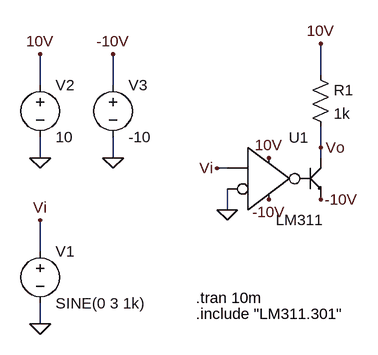
[diagram p0: schematic transferFunction.asc]
transferFunction.asc, the LTspice schematic file:
Version 4
SHEET 1 1300 680
WIRE 960 0 960 -48
WIRE 528 16 528 -32
WIRE 640 16 640 -32
WIRE 960 112 960 80
WIRE 528 128 528 96
WIRE 640 128 640 96
WIRE 960 128 960 112
WIRE 816 144 800 144
WIRE 816 208 816 176
WIRE 528 272 528 224
WIRE 528 384 528 352
FLAG 528 128 0
FLAG 528 384 0
FLAG 528 -32 10V
FLAG 640 128 0
FLAG 640 -32 -10V
FLAG 528 224 Vi
FLAG 880 128 10V
FLAG 880 192 -10V
FLAG 960 -48 10V
FLAG 816 208 0
FLAG 960 192 -10V
FLAG 960 112 Vo
FLAG 800 144 Vi
SYMBOL voltage 528 256 R0
WINDOW 123 0 0 Left 0
WINDOW 39 0 0 Left 0
SYMATTR InstName V1
SYMATTR Value SINE(0 3 1k)
SYMBOL voltage 528 0 R0
WINDOW 123 0 0 Left 0
WINDOW 39 0 0 Left 0
SYMATTR InstName V2
SYMATTR Value 10
SYMBOL voltage 640 0 R0
WINDOW 123 0 0 Left 0
WINDOW 39 0 0 Left 0
SYMATTR InstName V3
SYMATTR Value -10
SYMBOL res 944 -16 R0
SYMATTR InstName R1
SYMATTR Value 1k
SYMBOL LM311 1040 144 R0
SYMATTR InstName U1
TEXT 768 368 Left 2 !.include "LM311.301"
TEXT 768 344 Left 2 !.tran 10m

The netlist it stands for:
* transferFunction.asc
V1 Vi 0 SINE(0 3 1k)
V2 10V 0 10
V3 -10V 0 -10
R1 10V Vo 1k
XU1 0 Vi 10V -10V Vo -10V LM311  ; pins 1 2 3 4 5 6
.include "LM311.301"
.tran 10m
.lib C:\Users\ruizc\Google Drive\YouTube\Curso LTSpice\15 - Creación de modelos y simulación por jerarquías\LM311.301
.backanno
.end